# EAGLE design Tag-ECG-1V0 (EAGLE 9.6.2)

## Sheet 1 of 2
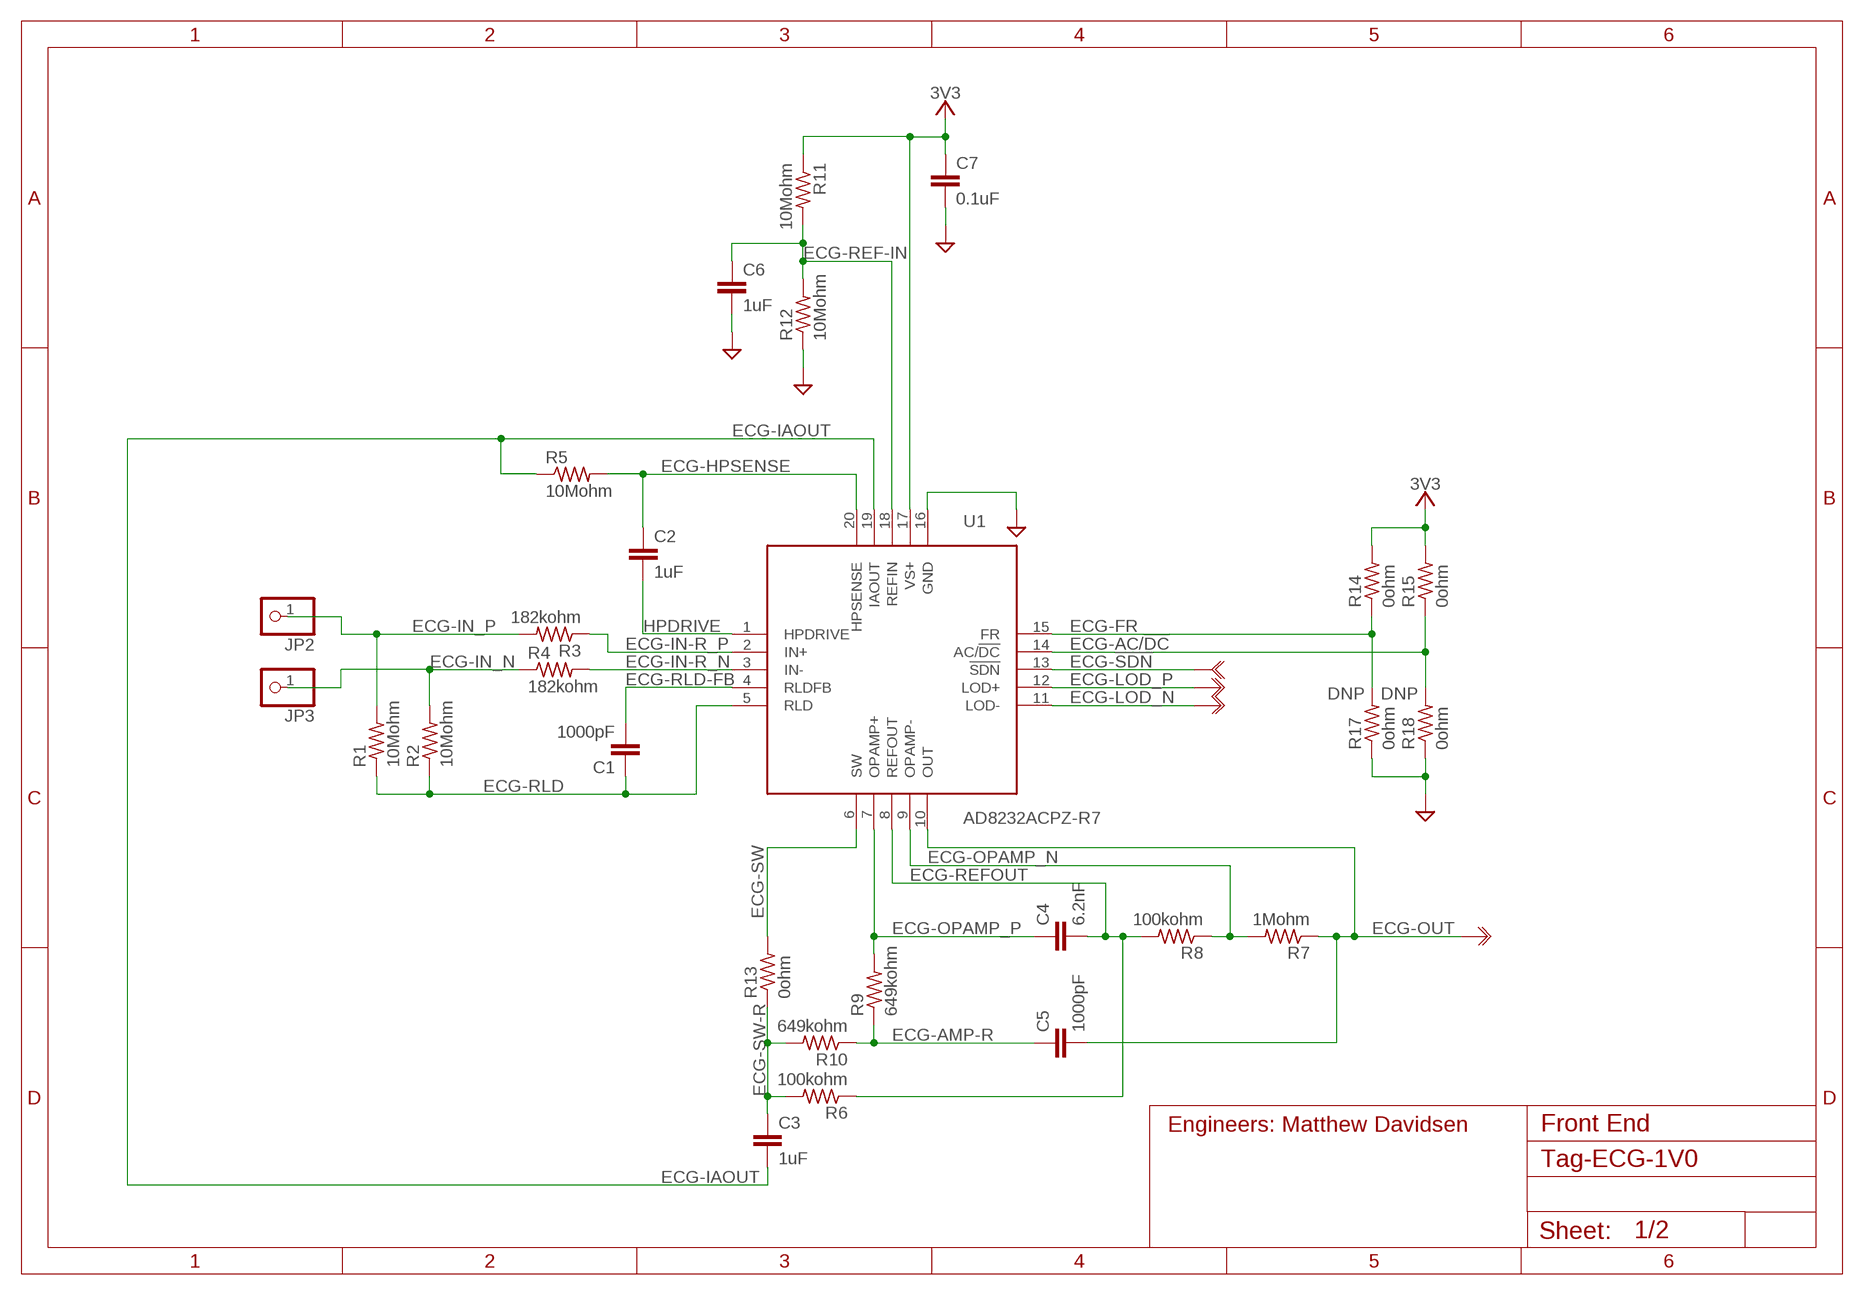
[diagram p0: schematic, sheet 1]
FRAME1 (A4L-LOC): NOTE: Engineers: Matthew Davidsen; SHEET_NAME: Front End

### Parts
C1  1000pF  CAP,CER,1000PF,2KV,10%,X7R,0402  [C0402]
C2  1uF  CAP,CER,1UF,10V,10%,X5R,0402  [C0402]
C3  1uF  CAP,CER,1UF,10V,10%,X5R,0402  [C0402]
C4  6.2nF  CAP,CER,6.2NF,25V,10%,X7R,0402  [C0402]
C5  1000pF  CAP,CER,1000PF,2KV,10%,X7R,0402  [C0402]
C6  1uF  CAP,CER,1UF,10V,10%,X5R,0402  [C0402]
C7  0.1uF  CAP,CER,0.1UF,16V,10%,X5R,0402  [C0402]
JP2  PINHD-1X1  [1X01]
JP3  PINHD-1X1  [1X01]
R1  10Mohm  RES,SMD,10MOHM,1%,1/10W,0402  [R0402]
R2  10Mohm  RES,SMD,10MOHM,1%,1/10W,0402  [R0402]
R3  182kohm  RES,SMD,182KOHM,1%,1/10W,0402  [R0402]
R4  182kohm  RES,SMD,182KOHM,1%,1/10W,0402  [R0402]
R5  10Mohm  RES,SMD,10MOHM,1%,1/10W,0402  [R0402]
R6  100kohm  RES,SMD,100KOHM,10%,1/10W,0402  [R0402]
R7  1Mohm  RES,SMD,1MOHM,1%,1/10W,0402  [R0402]
R8  100kohm  RES,SMD,100KOHM,10%,1/10W,0402  [R0402]
R9  649kohm  RES,SMD,649KOHM,1%,1/10W,0402  [R0402]
R10  649kohm  RES,SMD,649KOHM,1%,1/10W,0402  [R0402]
R11  10Mohm  RES,SMD,10MOHM,1%,1/10W,0402  [R0402]
R12  10Mohm  RES,SMD,10MOHM,1%,1/10W,0402  [R0402]
R13  0ohm  RES,SMD,0OHM,5%,1/16W,0402  [R0402]
R14  0ohm  RES,SMD,0OHM,5%,1/16W,0402  [R0402]
R15  0ohm  RES,SMD,0OHM,5%,1/16W,0402  [R0402]
R17  0ohm  RES,SMD,0OHM,5%,1/16W,0402  [R0402]
R18  0ohm  RES,SMD,0OHM,5%,1/16W,0402  [R0402]
U1  AD8232ACPZ-R7  [AD8232ACPZ-R7]
U$2  ON-PAGE  (no package)
U$5  OFF-PAGE  (no package)
U$6  OFF-PAGE  (no package)
U$11  V-RAIL  (no package)
U$12  V-RAIL  (no package)
U$39  OFF-PAGE  (no package)

### Nets
3V3: C7.1 R11.1 R14.2 R15.2 U1.17(VS+) U$11.V+ U$12.V+ ; also sheet 2
ECG-!SDN: U1.13(!SDN) U$2.IN ; also sheet 2
ECG-AC/!DC: R15.1 R18.2 U1.14(AC/!DC)
ECG-AMP-R: C5.1 R9.1 R10.1
ECG-FR: R14.1 R17.2 U1.15(FR)
ECG-HPSENSE: C2.1 R5.2 U1.20(HPSENSE)
ECG-IAOUT: C3.2 R5.1 U1.19(IAOUT) ; also sheet 2
ECG-IN-R_N: R4.2 U1.3(IN-)
ECG-IN-R_P: R3.1 U1.2(IN+)
ECG-IN_N: JP3.1 R2.2 R4.1 ; also sheet 2
ECG-IN_P: JP2.1 R1.2 R3.2 ; also sheet 2
ECG-LOD_N: U1.11(LOD-) U$39.OUT ; also sheet 2
ECG-LOD_P: U1.12(LOD+) U$6.OUT ; also sheet 2
ECG-OPAMP_N: R7.2 R8.1 U1.9(OPAMP-)
ECG-OPAMP_P: C4.1 R9.2 U1.7(OPAMP+)
ECG-OUT: C5.2 R7.1 U1.10(OUT) U$5.OUT ; also sheet 2
ECG-REF-IN: C6.1 R11.2 R12.2 U1.18(REFIN)
ECG-REFOUT: C4.2 R6.1 R8.2 U1.8(REFOUT)
ECG-RLD: C1.1 R1.1 R2.1 U1.5(RLD) ; also sheet 2
ECG-RLD-FB: C1.2 U1.4(RLDFB)
ECG-SW: R13.2 U1.6(SW)
ECG-SW-R: C3.1 R6.2 R10.2 R13.1
GND: C6.2 C7.2 R12.1 R17.1 R18.1 U1.16(GND) ; also sheet 2
HPDRIVE: C2.2 U1.1(HPDRIVE)

### Notes on the sheet
- DNP | DNP

## Sheet 2 of 2
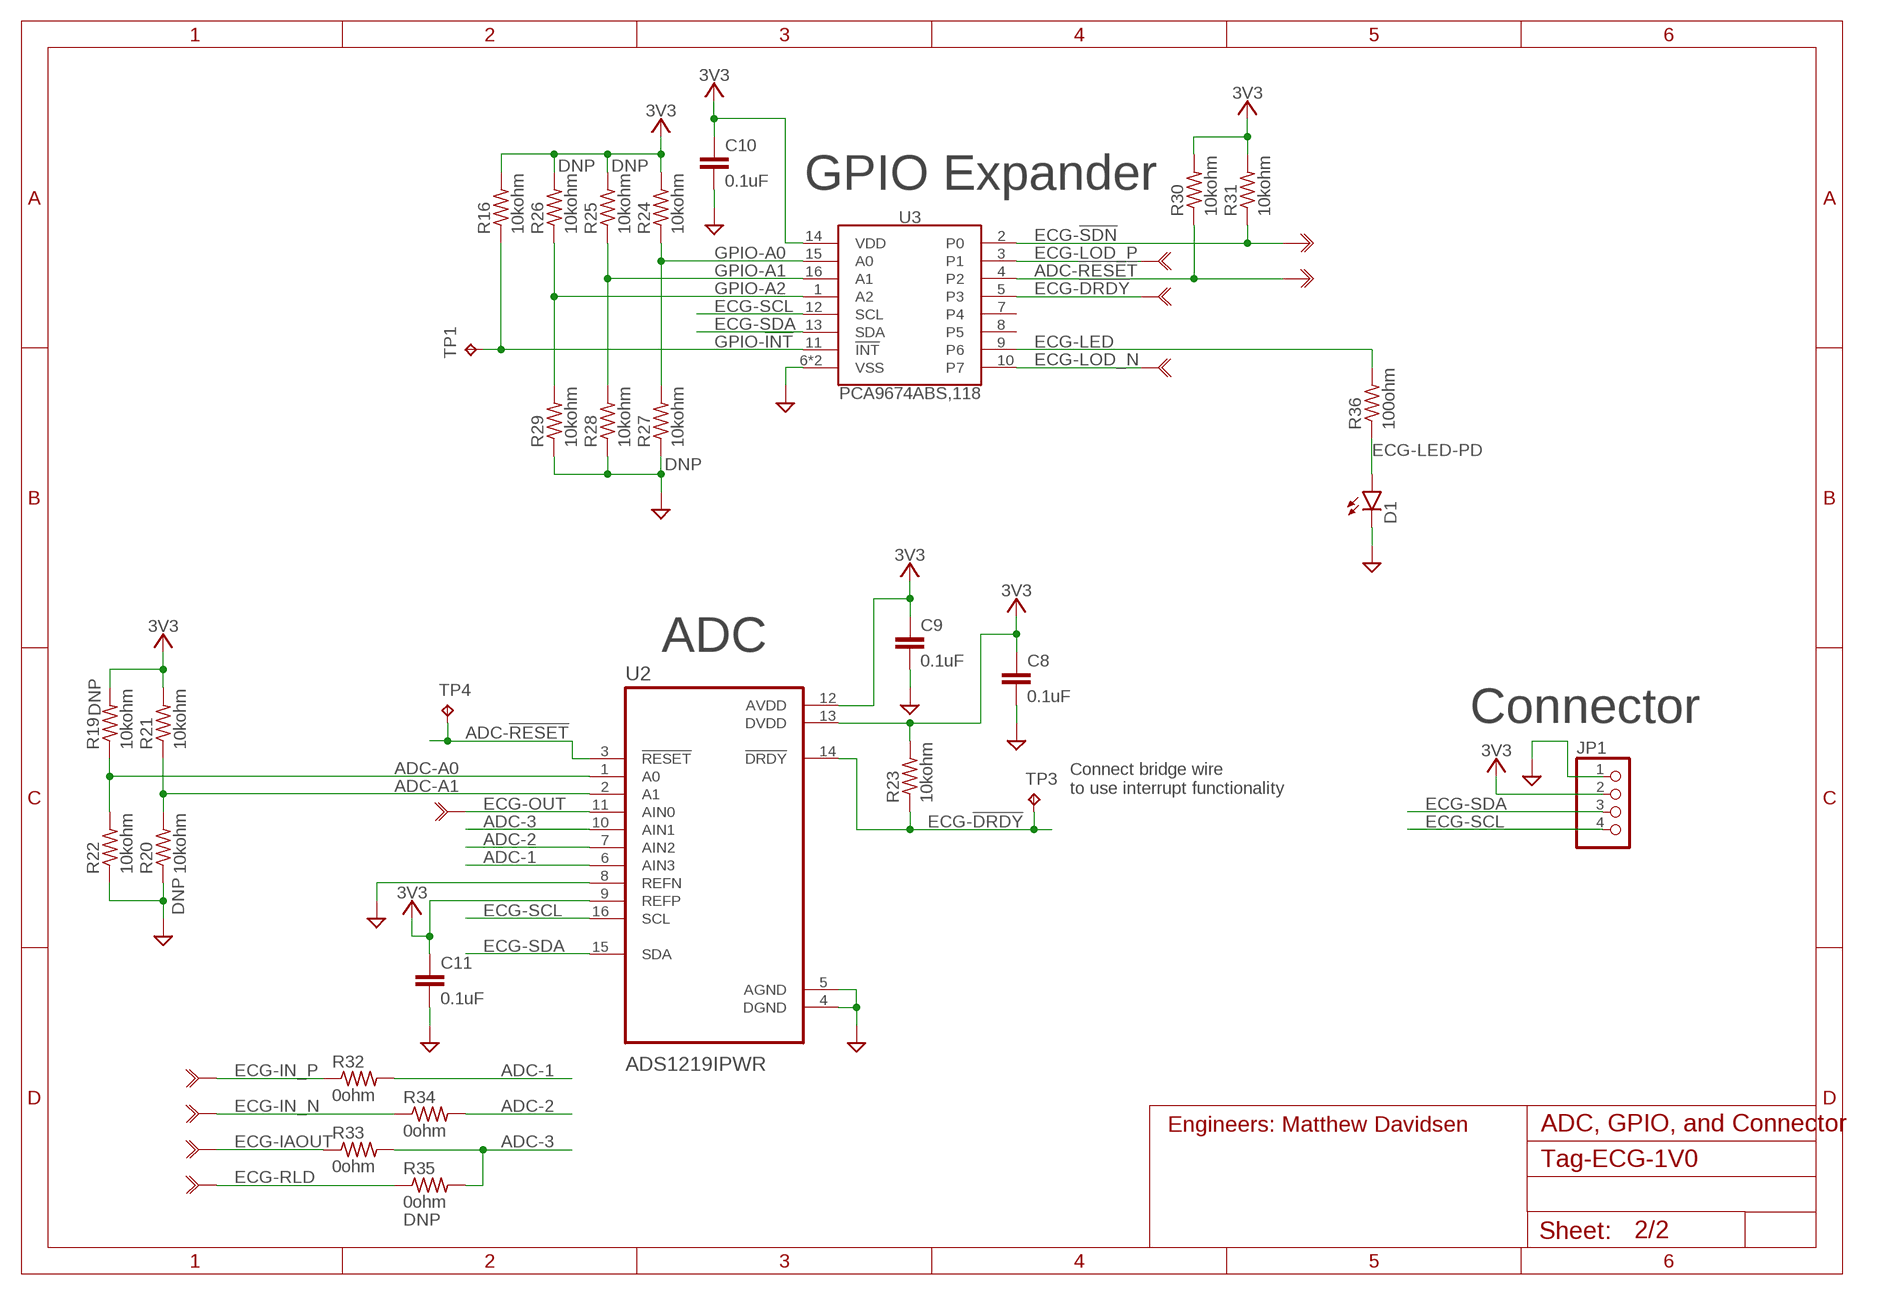
[diagram p1: schematic, sheet 2]
FRAME2 (A4L-LOC): NOTE: Engineers: Matthew Davidsen; SHEET_NAME: ADC, GPIO, and Connector

### Parts
C8  0.1uF  CAP,CER,0.1UF,16V,10%,X5R,0402  [C0402]
C9  0.1uF  CAP,CER,0.1UF,16V,10%,X5R,0402  [C0402]
C10  0.1uF  CAP,CER,0.1UF,16V,10%,X5R,0402  [C0402]
C11  0.1uF  CAP,CER,0.1UF,16V,10%,X5R,0402  [C0402]
D1  LED,SMD,GREEN,0603CHIP-LED0603  [CHIP-LED0603]
JP1  PINHD-1X4  [1X04]
R16  10kohm  RES,SMD,10KOHM,1%,1/16W,0402  [R0402]
R19  10kohm  RES,SMD,10KOHM,1%,1/16W,0402  [R0402]
R20  10kohm  RES,SMD,10KOHM,1%,1/16W,0402  [R0402]
R21  10kohm  RES,SMD,10KOHM,1%,1/16W,0402  [R0402]
R22  10kohm  RES,SMD,10KOHM,1%,1/16W,0402  [R0402]
R23  10kohm  RES,SMD,10KOHM,1%,1/16W,0402  [R0402]
R24  10kohm  RES,SMD,10KOHM,1%,1/16W,0402  [R0402]
R25  10kohm  RES,SMD,10KOHM,1%,1/16W,0402  [R0402]
R26  10kohm  RES,SMD,10KOHM,1%,1/16W,0402  [R0402]
R27  10kohm  RES,SMD,10KOHM,1%,1/16W,0402  [R0402]
R28  10kohm  RES,SMD,10KOHM,1%,1/16W,0402  [R0402]
R29  10kohm  RES,SMD,10KOHM,1%,1/16W,0402  [R0402]
R30  10kohm  RES,SMD,10KOHM,1%,1/16W,0402  [R0402]
R31  10kohm  RES,SMD,10KOHM,1%,1/16W,0402  [R0402]
R32  0ohm  RES,SMD,0OHM,5%,1/16W,0402  [R0402]
R33  0ohm  RES,SMD,0OHM,5%,1/16W,0402  [R0402]
R34  0ohm  RES,SMD,0OHM,5%,1/16W,0402  [R0402]
R35  0ohm  RES,SMD,0OHM,5%,1/16W,0402  [R0402]
R36  100ohm  RES,SMD,100OHM,5%,1/10W,0402  [R0402]
TP1  TPB1,27  [B1,27]
TP3  TPB1,27  [B1,27]
TP4  TPB1,27  [B1,27]
U2  ADS1219IPWR  [SOP65P640X120-16N]
U3  PCA9674ABS,118  [PCA9674ABS,118]
U$3  ON-PAGE  (no package)
U$4  ON-PAGE  (no package)
U$10  V-RAIL  (no package)
U$17  V-RAIL  (no package)
U$18  V-RAIL  (no package)
U$19  V-RAIL  (no package)
U$21  ON-PAGE  (no package)
U$22  ON-PAGE  (no package)
U$23  OFF-PAGE  (no package)
U$24  ON-PAGE  (no package)
U$25  ON-PAGE  (no package)
U$29  V-RAIL  (no package)
U$31  V-RAIL  (no package)
U$32  V-RAIL  (no package)
U$35  OFF-PAGE  (no package)
U$36  ON-PAGE  (no package)
U$37  V-RAIL  (no package)
U$40  ON-PAGE  (no package)

### Nets
3V3: C8.1 C9.1 C10.1 C11.1 JP1.2 R16.2 R19.2 R21.2 R23.2 R24.2 R25.2 R26.2 R30.2 R31.2 U2.9(REFP) U2.12(AVDD) U2.13(DVDD) U3.14(VDD) U$10.V+ U$17.V+ U$18.V+ U$19.V+ U$29.V+ U$31.V+ U$32.V+ U$37.V+ ; also sheet 1
ADC-1: R32.2 U2.6(AIN3)
ADC-2: R34.2 U2.7(AIN2)
ADC-3: R33.2 R35.2 U2.10(AIN1)
ADC-!RESET: R30.1 TP4.TP U2.3(!RESET) U3.4(P2) U$35.OUT
ADC-A0: R19.1 R22.2 U2.1(A0)
ADC-A1: R20.2 R21.1 U2.2(A1)
ECG-!DRDY: R23.1 TP3.TP U2.14(!DRDY) U3.5(P3) U$36.IN
ECG-!SDN: R31.1 U3.2(P0) U$23.OUT ; also sheet 1
ECG-IAOUT: R33.1 U$24.IN ; also sheet 1
ECG-IN_N: R34.1 U$25.IN ; also sheet 1
ECG-IN_P: R32.1 U$4.IN ; also sheet 1
ECG-LED: R36.2 U3.9(P6)
ECG-LED-PD: D1.A R36.1
ECG-LOD_N: U3.10(P7) U$40.IN ; also sheet 1
ECG-LOD_P: U3.3(P1) U$22.IN ; also sheet 1
ECG-OUT: U2.11(AIN0) U$21.IN ; also sheet 1
ECG-RLD: R35.1 U$3.IN ; also sheet 1
ECG-SCL: JP1.4 U2.16(SCL) U3.12(SCL)
ECG-SDA: JP1.3 U2.15(SDA) U3.13(SDA)
GND: C8.2 C9.2 C10.2 C11.2 D1.C JP1.1 R20.1 R22.1 R27.1 R28.1 R29.1 U2.4(DGND) U2.5(AGND) U2.8(REFN) U3.6(VSS) U3.17(VSS) ; also sheet 1
GPIO-!INT: R16.1 TP1.TP U3.11(!INT)
GPIO-A0: R24.1 R27.2 U3.15(A0)
GPIO-A1: R25.1 R28.2 U3.16(A1)
GPIO-A2: R26.1 R29.2 U3.1(A2)
Unconnected: U3.7(P4) U3.8(P5)

### Notes on the sheet
- DNP | DNP
- GPIO Expander
- DNP
- ADC
- DNP
- Connector
- Connect bridge wire
  to use interrupt functionality
- DNP
- DNP

## Library data of the parts
C1 C5 = 0-Standard-Passives:CAP,CER,1000PF,2KV,10%,X7R,0402
C2 C3 C6 = 0-Standard-Passives:CAP,CER,1UF,10V,10%,X5R,0402
C4 = 0-Standard-Passives:CAP,CER,6.2NF,25V,10%,X7R,0402
C7-C11 = 0-Standard-Passives:CAP,CER,0.1UF,16V,10%,X5R,0402
D1 = 0-Custom-Opto:LED,SMD,GREEN,0603
JP1 = pinhead:PINHD-1X4: PIN HEADER
JP2 JP3 = pinhead:PINHD-1X1: PIN HEADER
R1 R2 R5 R11 R12 = 0-Standard-Passives:RES,SMD,10MOHM,1%,1/10W,0402
R3 R4 = 0-Standard-Passives:RES,SMD,182KOHM,1%,1/10W,0402
R6 R8 = 0-Standard-Passives:RES,SMD,100KOHM,10%,1/10W,0402
R7 = 0-Standard-Passives:RES,SMD,1MOHM,1%,1/10W,0402
R9 R10 = 0-Standard-Passives:RES,SMD,649KOHM,1%,1/10W,0402
R13-R15 R17 R18 R32-R35 = 0-Standard-Passives:RES,SMD,0OHM,5%,1/16W,0402
R16 R19-R31 = 0-Standard-Passives:RES,SMD,10KOHM,1%,1/16W,0402
R36 = 0-Standard-Passives:RES,SMD,100OHM,5%,1/10W,0402
TP1 TP3 TP4 = testpad:TP: Test pad
U1 = AD8232ACPZ-R7:AD8232ACPZ-R7
U2 = ADS1219IPWR:ADS1219IPWR; DESCRIPTION: 24-bit, 1kSPS, 4-ch general-purpose delta-sigma ADC with I2C interface and external Vref inputs; DIGI-KEY_PART_NUMBER: 296-50884-2-ND; MF: Texas Instruments; MP: ADS1219IPWR; PACKAGE: TSSOP-16 Texas Instruments; PURCHASE-URL: https://pricing.snapeda.com/search/part/ADS1219IPWR/?ref=eda
U3 = PCA9674ABS,118:PCA9674ABS,118; A_MAX: 1.0; B_MAX: 0.3; B_MIN: 0.18; B_NOM: 0.24; D2_NOM: 1.5; D_MAX: 3.1; D_MIN: 2.9; D_NOM: 3.0; E2_NOM: 1.5; ENOM: 0.5; E_MAX: 3.1; E_MIN: 2.9; E_NOM: 3.0; L_MAX: 0.5; L_MIN: 0.3; L_NOM: 0.4; MANUFACTURER: NXP USA; PIN_COUNT_D: 4.0; PIN_COUNT_E: 4.0; SNAPEDA_PACKAGE_ID: 5149; STANDARD: IPC 7351B
U$2-U$4 U$21 U$22 U$24 U$25 U$36 U$40 = 0-Custom-Markers:ON-PAGE
U$5 U$6 U$23 U$35 U$39 = 0-Custom-Markers:OFF-PAGE
U$10-U$12 U$17-U$19 U$29 U$31 U$32 U$37 = 0-Custom-Markers:V-RAIL

## Board
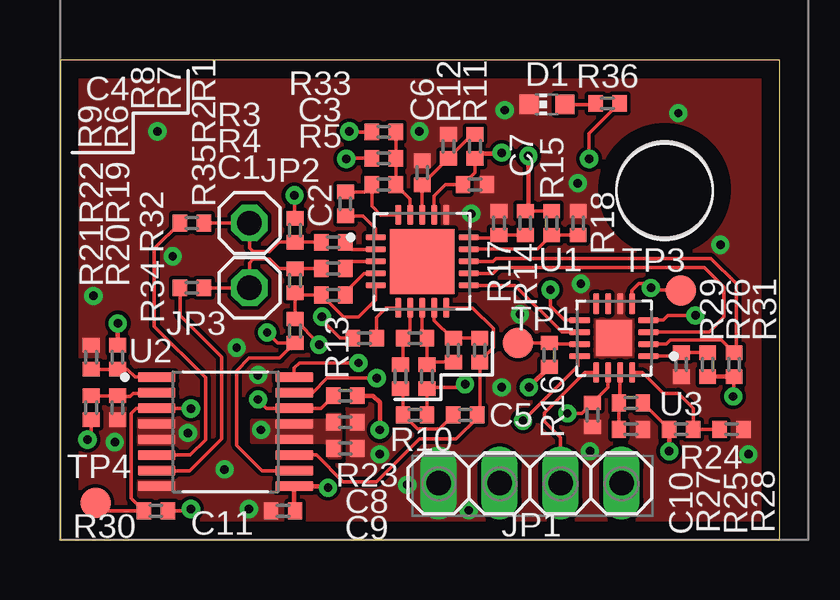
[diagram p2: board, top side]
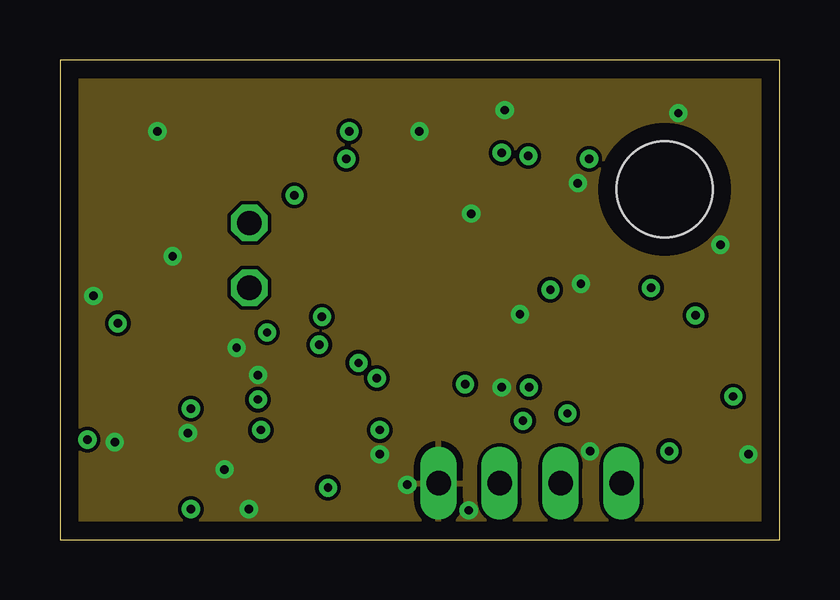
[diagram p3: board, inner layer Route2]
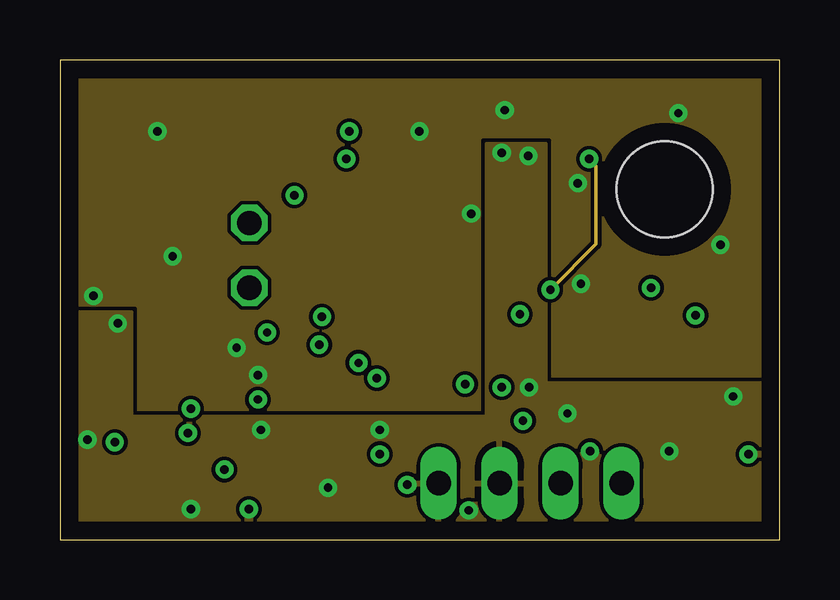
[diagram p4: board, inner layer Route15]
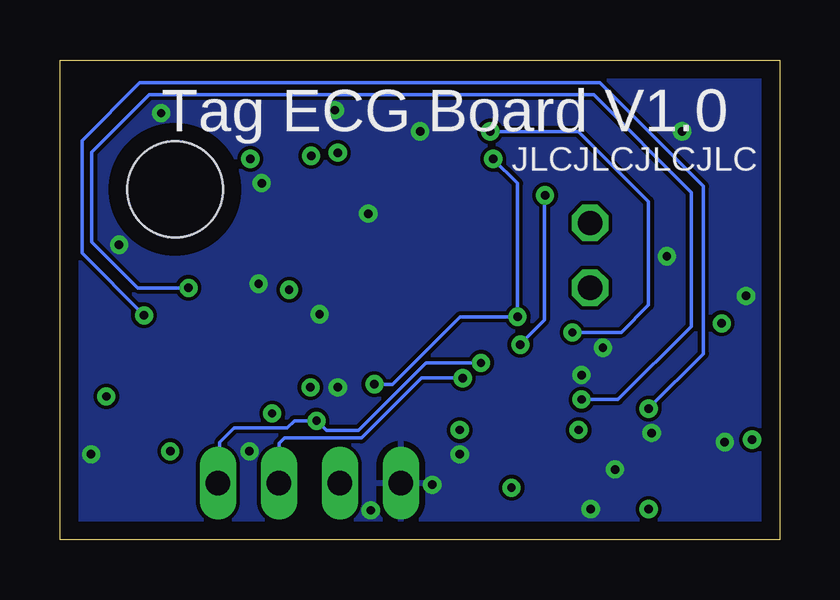
[diagram p5: board, bottom side, seen from below]

Size 30 x 20 mm. Coordinates in mm from the lower left corner, seen from the top.
Outline: 0,0 30,0 30,20 0,20 0,0
Copper layers (1+2*15+16): Top 0.035mm / dielectric 0.31mm / Route2 0.035mm / dielectric 0.15mm / Route15 0.035mm / dielectric 0.2mm / Bottom 0.035mm
Design rules "default *": minimum track width 6mil, minimum drill 0.35mm, track to track 6mil, track to pad 6mil, pad to pad 6mil, via to via 6mil, smd to smd 6mil, copper to edge 30mil, drill to drill 6mil, minimum pad ring 10mil, minimum via ring 8mil, stop-mask expansion 4mil, vias tented up to drill 0mil, thermal gap 10mil
Holes 4 mm at 25.2,14.6

### Footprints (pad centres in the part's own frame; a part is rotated, then mirrored left to right if it is on the bottom)
C0402 = smd 0.6 x 0.7: 1 -0.5,0; 2 0.5,0
CHIP-LED0603 = smd 0.8 x 0.8: A 0,-0.75; C 0,0.75
1X04 = drill 1.016 long: 1 -3.81,0; 2 -1.27,0; 3 1.27,0; 4 3.81,0
1X01 = drill 1.016 octagon: 1 0,0
R0402 = smd 0.6 x 0.7: 1 -0.5,0; 2 0.5,0
B1,27 = smd 1.27 x 1.27: TP 0,0
AD8232ACPZ-R7 = smd 0.84 x 0.26: 1 -1.935,1; 2 -1.935,0.5; 3 -1.935,0; 4 -1.935,-0.5; 5 -1.935,-1; 11 1.935,-1; 12 1.935,-0.5; 13 1.935,0; 14 1.935,0.5; 15 1.935,1 | smd 0.26 x 0.84: 6 -1,-1.935; 7 -0.5,-1.935; 8 0,-1.935; 9 0.5,-1.935; 10 1,-1.935; 16 1,1.935; 17 0.5,1.935; 18 0,1.935; 19 -0.5,1.935; 20 -1,1.935 | smd 2.7 x 2.7: 21 0,0
SOP65P640X120-16N = smd 1.57 x 0.41: 1 -2.87,2.275; 2 -2.87,1.625; 3 -2.87,0.975; 4 -2.87,0.325; 5 -2.87,-0.325; 6 -2.87,-0.975; 7 -2.87,-1.625; 8 -2.87,-2.275; 9 2.87,-2.275; 10 2.87,-1.625; 11 2.87,-0.975; 12 2.87,-0.325; 13 2.87,0.325; 14 2.87,0.975; 15 2.87,1.625; 16 2.87,2.275
PCA9674ABS,118 = smd 0.86 x 0.26: 1 -1.435,0.75; 2 -1.435,0.25; 3 -1.435,-0.25; 4 -1.435,-0.75; 9 1.435,-0.75; 10 1.435,-0.25; 11 1.435,0.25; 12 1.435,0.75 | smd 0.26 x 0.86: 5 -0.75,-1.435; 6 -0.25,-1.435; 7 0.25,-1.435; 8 0.75,-1.435; 13 0.75,1.435; 14 0.25,1.435; 15 -0.25,1.435; 16 -0.75,1.435 | smd 1.5 x 1.5: 17 0,0

### Placement (x,y rotation side)
C1  11.4,10.2 0 top
C2  11.9,14 270 top
C3  13.5,15.9 0 top
C4  14.8,8.4 0 top
C5  16.9,5.2 0 top
C6  15.1,15.3 90 top
C7  17.3,14.8 0 top
C8  11.9,4.9 0 top
C9  11.9,3.8 0 top
C10  22.2,5.2 270 top
C11  9.3,1.2 180 top
D1  20.3,18.14 90 top
JP1  19.6,2.35 0 top
JP2  7.9,13.2 0 top
JP3  7.9,10.5 0 top
R1  9.8,12.9 270 top
R2  9.8,10.8 90 top
R3  11.4,12.4 180 top
R4  11.4,11.3 0 top
R5  13.5,14.8 180 top
R6  15.3,6.8 270 top
R7  17.5,7.9 90 top
R8  16.4,7.9 270 top
R9  14.2,6.8 90 top
R10  14.8,5.2 0 top
R11  17.3,16.4 90 top
R12  16.2,16.4 270 top
R13  12.7,8.4 0 top
R14  19.4,13.2 90 top
R15  20.5,13.2 90 top
R16  20.4,7.7 270 top
R17  18.3,13.2 270 top
R18  21.6,13.2 270 top
R19  2.4,7.6 90 top
R20  2.4,5.5 90 top
R21  1.3,5.5 270 top
R22  1.3,7.6 270 top
R23  11.9,6 0 top
R24  23.8,5.7 0 top
R25  25.9,4.6 180 top
R26  27,7.3 270 top
R27  23.8,4.6 180 top
R28  28,4.6 180 top
R29  25.9,7.3 90 top
R30  4,1.2 0 top
R31  28.1,7.3 270 top
R32  5.5,13.2 180 top
R33  13.5,17 180 top
R34  5.5,10.5 180 top
R35  9.8,8.7 270 top
R36  22.82,18.19 0 top
TP1  19.1,8.2 180 top
TP3  25.88,10.39 180 top
TP4  1.48,1.53 180 top
U1  15.1,11.6 0 top
U2  6.9,4.5 0 top
U3  23.1,8.4 180 top

### Tracks (layer width: path | path; a pad name or v marks a point on that pad's centre or on a via)
3V3  (via drill 0.35)
  Top 0.152: U3.14 22.85,6.35 C10.1 21.76,5.26 v21.16,5.26 | U1.17 15.6,14.33 16.07,14.8 C7.1 17.3,15.3 R11.1 | R15.2 R14.2 | R24.2 R25.2 | R21.2 1.3,4.32 v1.14,4.17 | R30.2 5.39,1.2 v5.46,1.27 | R31.2 28.1,6 v28.07,5.97
  Top 0.178: R16.2 v19.56,6.36 v19.56,6.35 | R26.2 R31.2 | C11.1 9.77,1.2 U2.9 11.18,2.23 v11.18,2.16 | R19.2 2.4,9 v2.41,9.02 | R11.1 17.5,16.1 18.39,16.1 v18.41,16.13 | R14.2 19.53,13.83 v19.53,16 | R23.2 13.05,6 13.34,5.71 v13.34,4.57 | R25.2 v25.4,3.68
  other vias: 8.38,4.57
  pour Top (no thermals): 8,4.95 11.18,4.95 11.18,5.21 11.68,5.21 11.68,3.43 11.18,3.43 11.18,4.06 8,4.06
  pour Route15: 30,0 0,0 0,9.49 2.98,9.49 2.98,5.14 17.78,5.14 17.78,16.51 20.25,16.51 20.25,6.54 30,6.54
ADC-1
  Top 0.152: U2.6 5.43,3.52 6.07,4.16 6.07,6.76 3.94,8.89 3.94,12.14 R32.2
ADC-2
  Top 0.152: U2.7 5.42,2.88 6.73,4.19 6.73,7.62 5,9.35 R34.2
ADC-3  (via drill 0.35)
  Top 0.152: U2.10 8.43,2.88 7.37,3.94 7.37,7.04 7.89,7.57 9.16,7.57 R35.2 9.07,8.2 v8.64,8.64 | R33.2 12.08,17 v12.06,17.02
  Bottom 0.152: v12.06,17.02 8.38,17.02 5.46,14.1 5.46,9.78 6.6,8.64 v8.64,8.64
ADC-!RESET  (via drill 0.35)
  Top 0.152: U3.4 25.15,9.15 25.35,9.35 v26.5,9.35 | v5.46,5.46 4.04,5.46 U2.3 4.02,5.46 3.17,5.46 2.98,5.26 2.98,1.72 R30.1 1.81,1.2 TP4.TP
  Bottom 0.152: v5.46,5.46 3.17,7.75 3.17,14.73 7.49,19.05 26.67,19.05 29.08,16.64 29.08,11.94 v26.5,9.35
ADC-A0
  Top 0.152: U2.1 3.13,6.78 2.81,7.1 R19.1 R22.2
ADC-A1
  Top 0.152: U2.2 4,6.1 3.05,6.1 2.92,5.97 2.43,5.97 R20.2 R21.1
ECG-!DRDY  (via drill 0.35)
  Top 0.152: U3.5 23.85,10.39 24.13,10.67 24.46,10.67 v24.64,10.49 24.72,10.41 25.86,10.41 TP3.TP | v8.26,5.84 8.62,5.47 U2.14 10.88,5.47 R23.1
  Bottom 0.152: v8.26,5.84 6.73,5.84 3.68,8.89 3.68,14.48 7.75,18.54 26.29,18.54 28.67,16.16 28.67,12.41 26.76,10.49 v24.64,10.49
ECG-!SDN
  Top 0.152: U3.2 25.28,8.15 25.45,8.33 27.57,8.33 R31.1 28.19,7.89 28.19,10.67 27.14,11.73 18.18,11.73 18.05,11.6 U1.13
ECG-AC/!DC
  Top 0.152: U1.14 19.91,12.11 R15.1 R18.2
ECG-AMP-R
  Top 0.152: R9.1 14.3,6.2 R10.1 14.33,5.2 14.9,4.62 15.82,4.62 C5.1
ECG-FR
  Top 0.152: U1.15 17.06,12.57 18.17,12.57 R17.2 R14.1
ECG-HPSENSE
  Top 0.152: U1.20 13.36,13.54 13,13.9 R5.2 12.7,14.5 C2.1
ECG-IAOUT
  Top 0.152: U1.19 14.6,14.2 R5.1 C3.2 R33.1
ECG-IN-R_N
  Top 0.152: U1.3 12.2,11.6 R4.2
ECG-IN-R_P
  Top 0.152: U1.2 12.2,12.1 R3.1
ECG-IN_N
  Top 0.152: R4.1 R2.2 9.14,11.3 8.75,11.7 8.06,11.7 7.9,11.54 JP3.1 R34.1
ECG-IN_P
  Top 0.152: R3.2 R1.2 9.14,12.4 8.75,12 8.06,12 7.9,12.16 JP2.1 R32.1
ECG-LED  (via drill 0.35)
  Top 0.152: R36.2 22.06,16.93 v22.06,15.88 | U3.9 21.03,9.15 20.45,9.73 v20.45,10.41
  Route15 0.152: v20.45,10.41 22.35,12.32 22.35,15.58 v22.06,15.88
ECG-LED-PD
  Top 0.152: R36.1 22.32,18.14 D1.A
ECG-LOD_N
  Top 0.152: U3.10 20.92,8.65 18.97,10.6 U1.11
ECG-LOD_P
  Top 0.152: U1.12 18.05,11.1 18.3,11.35 26.87,11.35 27.69,10.54 27.69,9.27 27.07,8.65 U3.3
ECG-OPAMP_N
  Top 0.152: U1.9 15.6,9.14 16.34,8.4 R8.1 R7.2
ECG-OPAMP_P
  Top 0.152: U1.7 14.6,8.7 C4.1 14.3,7.4 R9.2
ECG-OUT
  Top 0.152: U1.10 17.21,9.66 18.08,8.79 18.08,8.01 17.5,7.43 R7.1 17.5,5.3 C5.2 17.4,5.08 16.51,4.19 14.99,4.19 13.21,2.41 11.81,2.41 10.7,3.52 U2.11
ECG-REF-IN
  Top 0.152: U1.18 C6.1 R12.2 17.2,16.9 R11.2
ECG-REFOUT
  Top 0.152: U1.8 15.1,8.6 C4.2 R6.1 15.4,7.4 R8.2
ECG-RLD  (via drill 0.35)
  Top 0.152: U1.5 13.16,9.99 12.45,9.27 11.83,9.27 C1.1 9.9,10.2 R2.1 R35.1 9.8,9.17 10.81,8.17 v10.81,8.13 | R1.1 9.78,13.42 v9.78,14.35
  Bottom 0.152: v10.81,8.13 10.81,8.17 9.81,9.17 9.81,14.32 v9.78,14.35
ECG-RLD-FB
  Top 0.152: U1.4 12.67,11.1 11.9,10.33 C1.2
ECG-SCL  (via drill 0.35)
  Top 0.152: U2.16 9.77,7.16 9.98,7.37 v12.45,7.37 | U3.12 21.59,7.58 21.59,7.24 v19.3,4.95
  Bottom 0.152: JP1.4 23.34,2.42 23.34,4.06 22.75,4.65 20.52,4.65 20.22,4.95 v19.3,4.95 18.89,4.54 17.55,4.54 14.73,7.37 v12.45,7.37
ECG-SDA  (via drill 0.35)
  Top 0.152: U3.13 22.34,6.97 21.88,6.97 20.19,5.28 20.19,4.93 20.87,4.25 JP1.3 | v13.21,6.73 v13.2,6.74 11.14,6.74 10.53,6.12 U2.15
  Bottom 0.152: JP1.3 20.87,4 20.63,4.24 17.43,4.24 14.94,6.73 v13.21,6.73
ECG-SW
  Top 0.152: U1.6 14.09,9.65 13.59,9.65 13.2,9.26 R13.2
ECG-SW-R  (via drill 0.35)
  Top 0.152: R10.2 R6.2 15.3,6.35 16.76,6.35 v16.89,6.48 | R13.1 11.69,8.4 10.92,9.16 v10.92,9.29 | v11.94,15.88 11.96,15.9 C3.1
  Bottom 0.152: v11.94,15.88 10.92,14.86 v10.92,9.29 13.31,9.29 16.13,6.48 v16.89,6.48
GND  (via drill 0.35)
  other vias: 4.06,17.02 6.86,2.92 17.14,13.59 21.59,14.86 14.99,17.02 1.4,10.16 28.7,3.56 14.48,2.29 21.72,10.67 4.7,11.81 7.37,8 27.53,12.29 18.41,6.35 22.1,3.68 2.29,4.06 5.33,4.45 7.87,1.27 13.34,3.56 17.04,1.22 18.54,17.91 19.18,9.4 8.26,6.86 25.78,17.78
  pour Top (rank 2, no thermals): 0,20 30,20 30,0 0,0
  pour Bottom (rank 2): 0,20 30,20 30,0 0,0
  pour Route2: 0,20 30,20 30,0 0,0
  pour Route15 (rank 2): 0,20 30,20 30,0 0,0
GPIO-!INT
  Top 0.152: U3.11 20.45,8.15 R16.1 TP1.TP
GPIO-A0
  Top 0.152: R27.2 R24.1 23.35,5.75 U3.15
GPIO-A1
  Top 0.152: U3.16 24.28,6.96 25.15,6.1 25.78,6.1 26.4,5.48 R25.1 R28.2
GPIO-A2
  Top 0.152: U3.1 25.75,7.65 R29.2 R26.1
HPDRIVE
  Top 0.152: U1.1 13.16,12.97 12.63,13.5 C2.2

### Text on the board
bPlace: Tag ECG Board V1.0 | JLCJLCJLCJLC